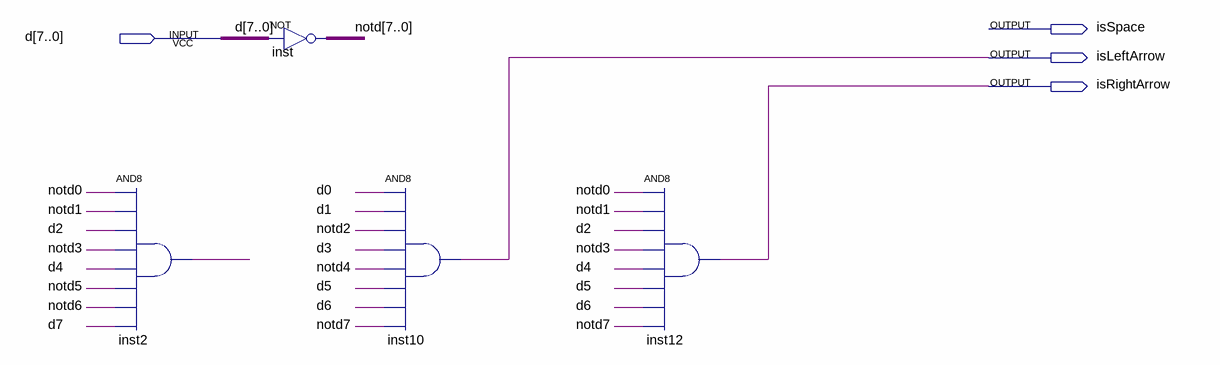
[diagram p0: schematic sheet]
// Quartus schematic KeyDetector.bdf as structural Verilog: 4 symbols, 4 pins
module KeyDetector (
  input  [7:0] d,
  output isSpace,
  output isLeftArrow,
  output isRightArrow
);

  wire inst2_out;
  wire [7:0] notd;

  and inst2 (inst2_out, notd[0], notd[1], d[2], notd[3], d[4], notd[5], notd[6], d[7]);
  assign notd = ~d;  // NOT inst, 8 bits wide
  and inst10 (isLeftArrow, d[0], d[1], notd[2], d[3], notd[4], d[5], d[6], notd[7]);
  and inst12 (isRightArrow, notd[0], notd[1], d[2], notd[3], d[4], d[5], d[6], notd[7]);
endmodule
